# Altium schematic sheet AI_XiaoZhi_4G.SchDoc
size A2; SheetNumber: 1; SheetTotal: 1
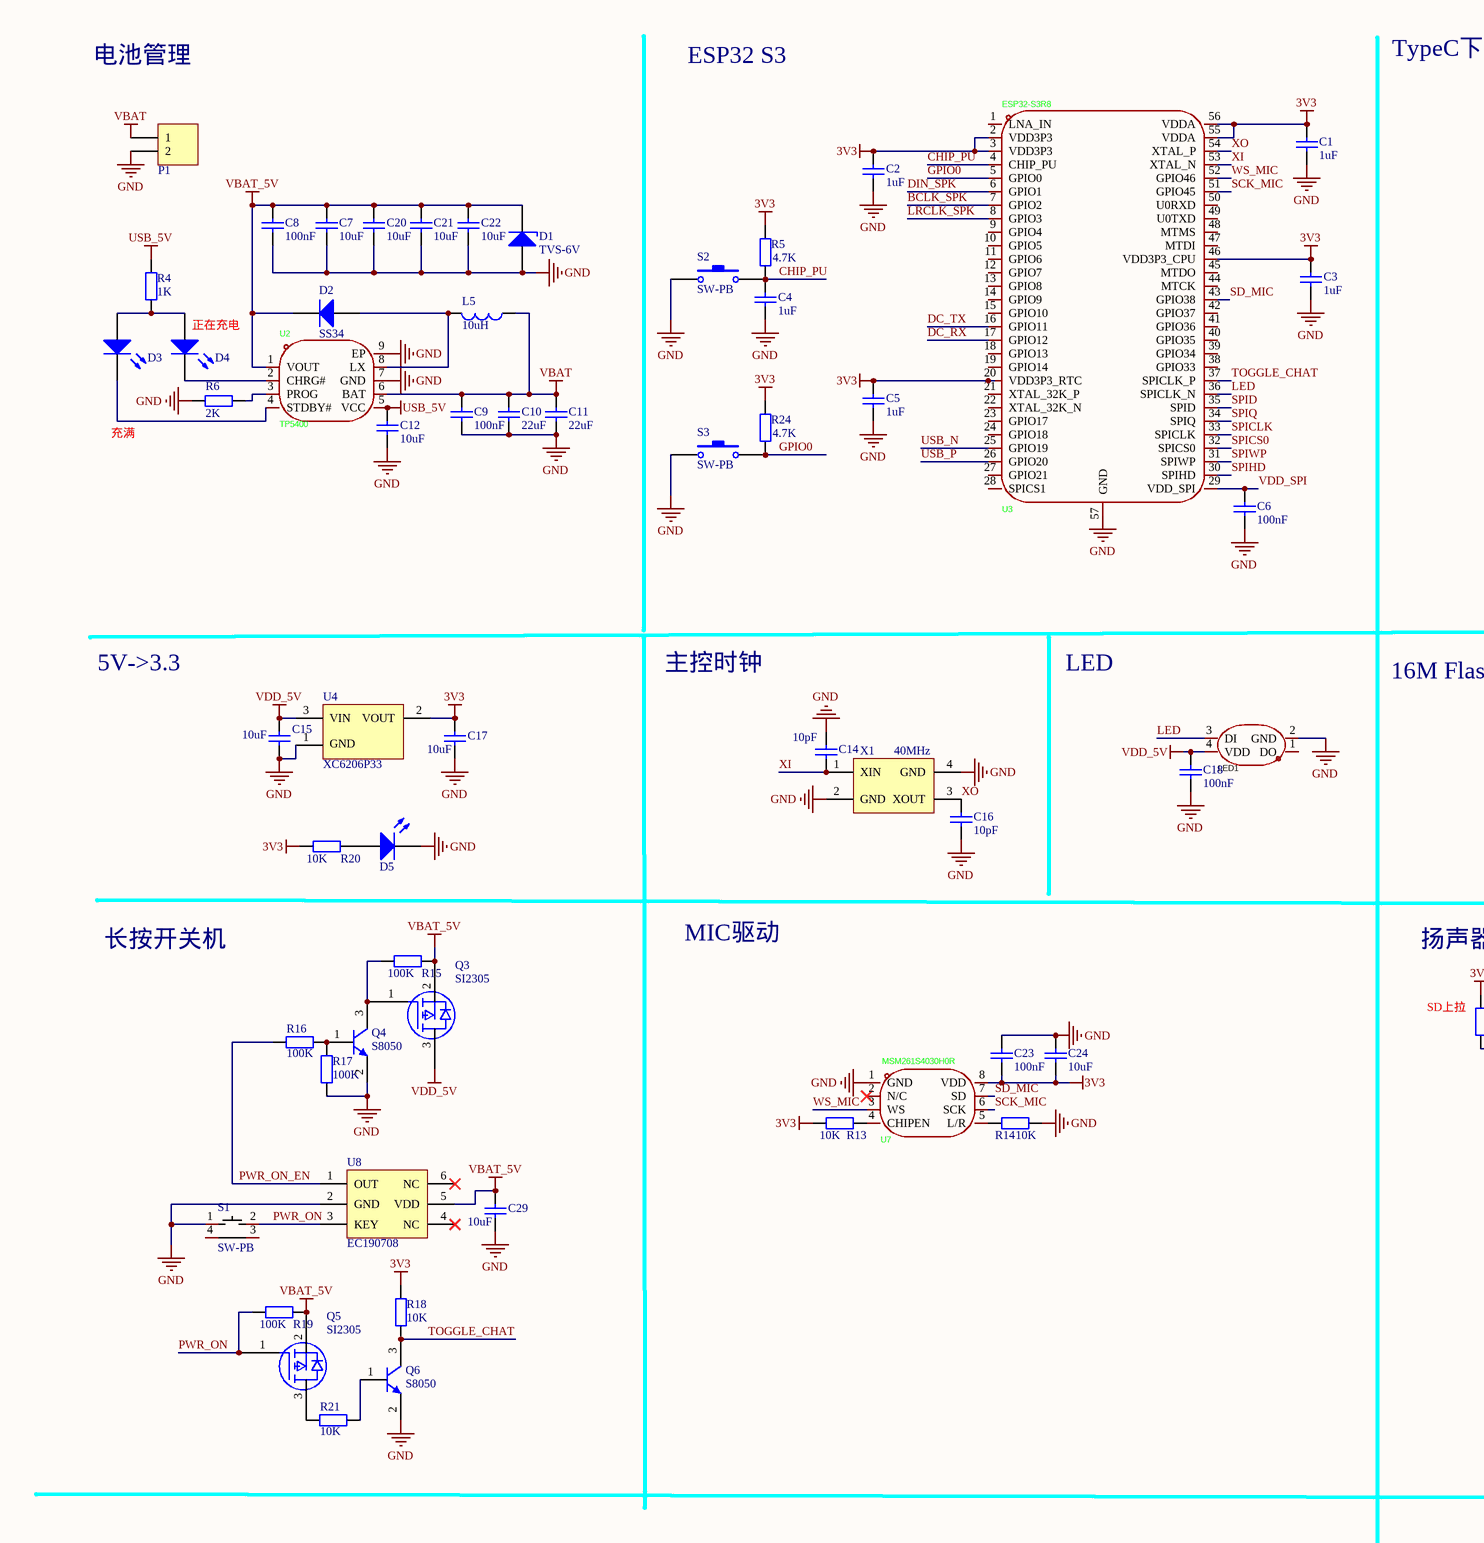
[diagram p0: AI_XiaoZhi_4G.SchDoc, left]
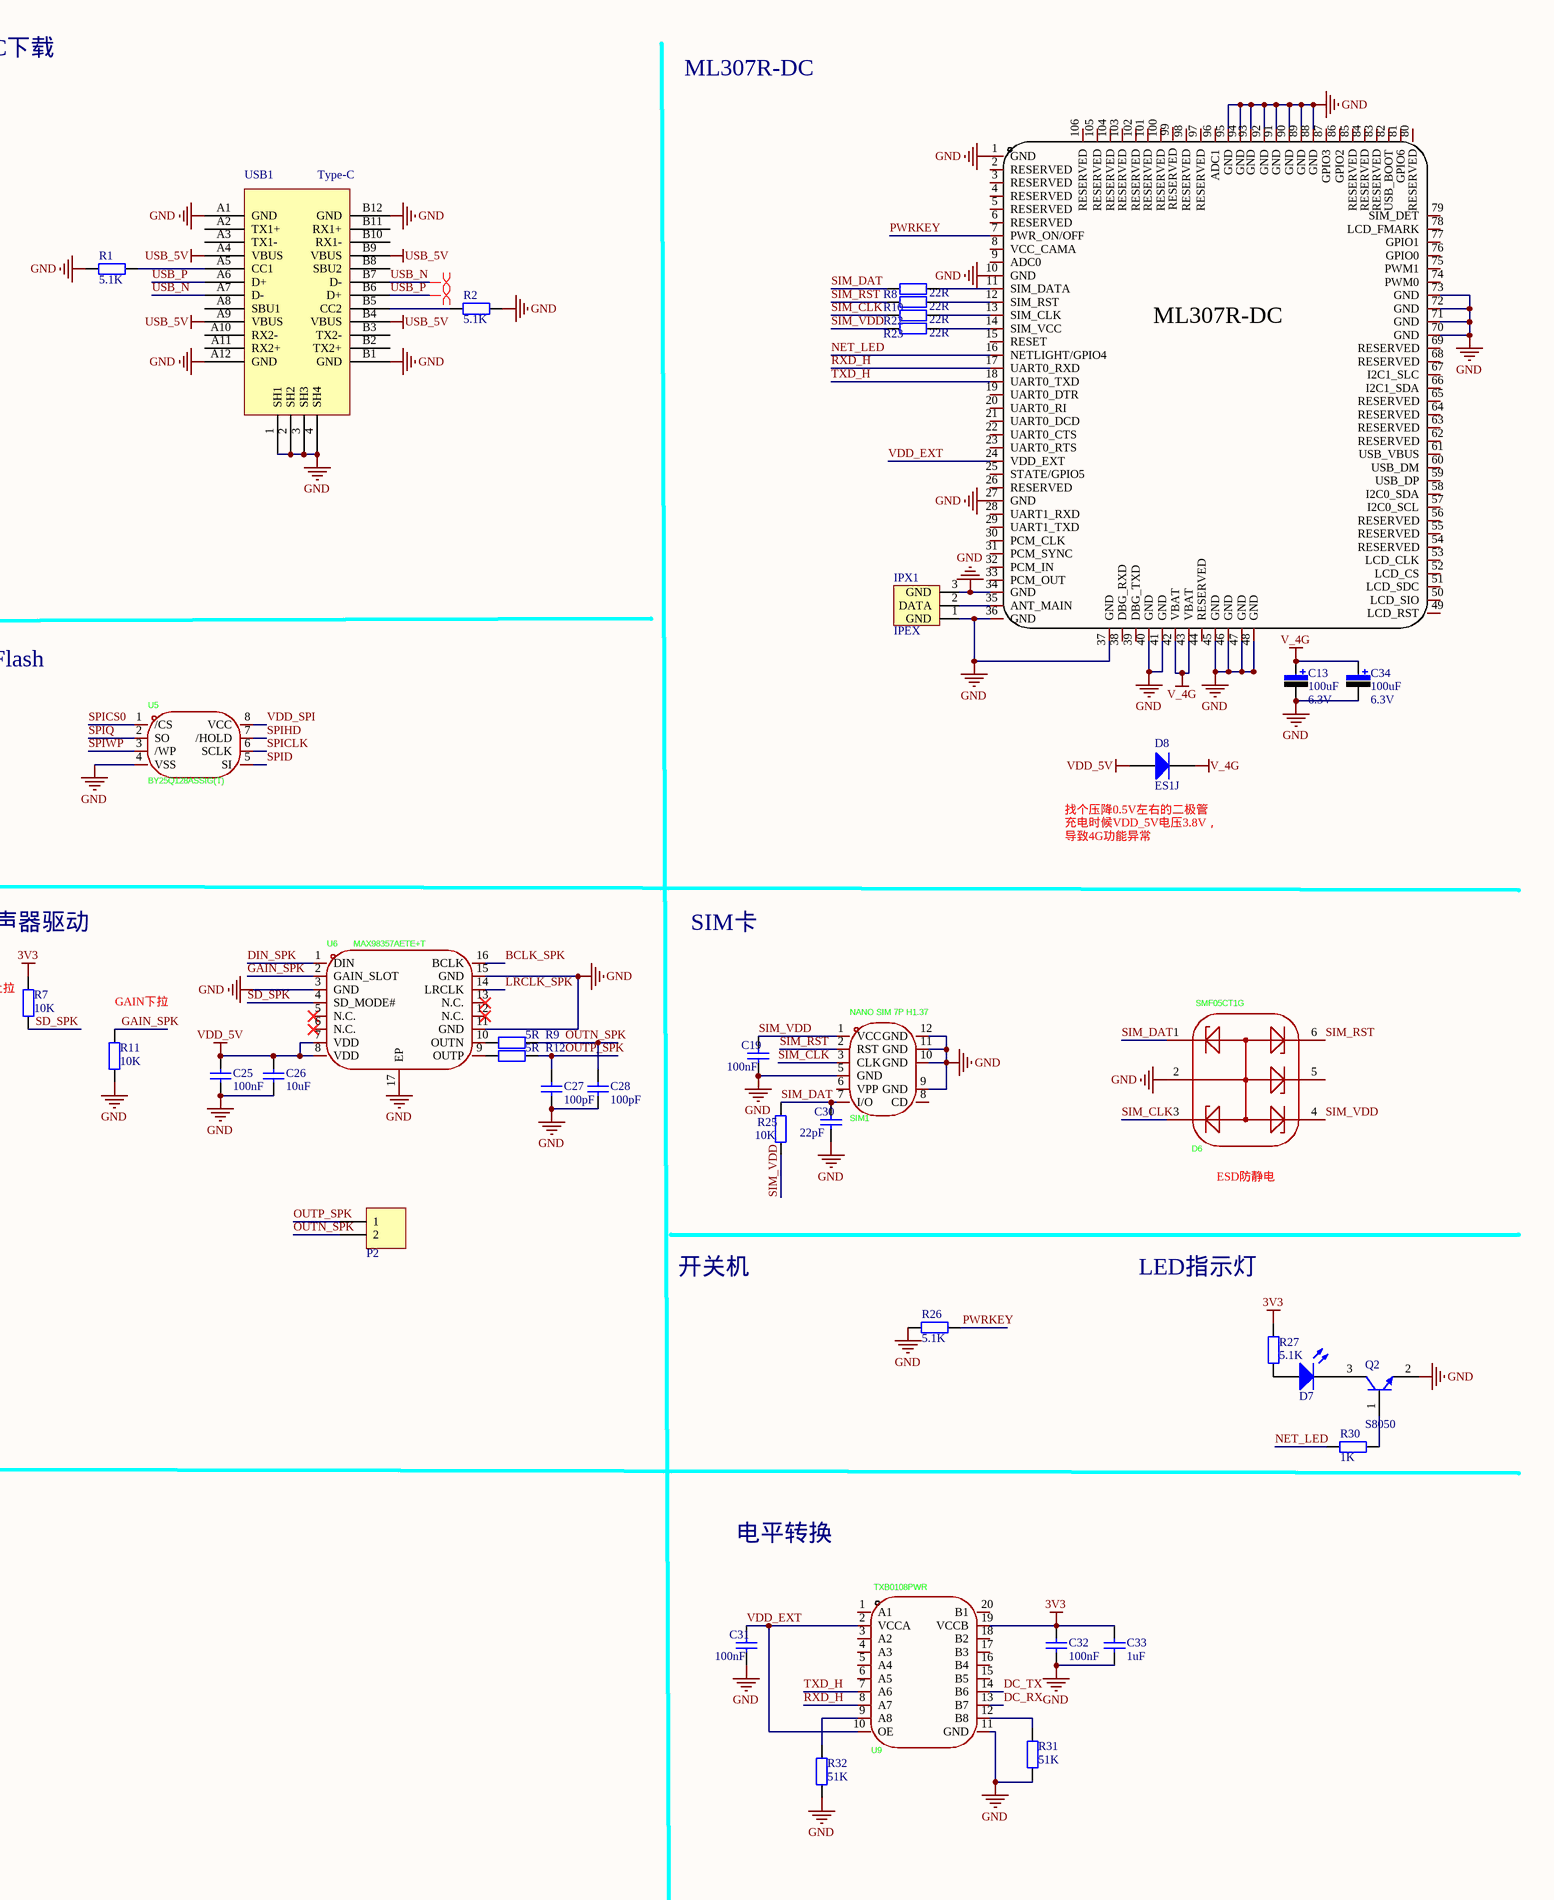
[diagram p1: AI_XiaoZhi_4G.SchDoc, right]

## Parts
C1  value 1uF  [0603-C]  (hidden comment: CAP)
C2  value 1uF  [0603-C]  (hidden comment: CAP)
C3  value 1uF  [0603-C]  (hidden comment: CAP)
C4  value 1uF  [0603-C]  (hidden comment: CAP)
C5  value 1uF  [0603-C]  (hidden comment: CAP)
C6  value 100nF  [0603-C]  (hidden comment: CAP)
C7  value 10uF  [0603-C]  (hidden comment: CAP)
C8  value 100nF  [0603-C]  (hidden comment: CAP)
C9  value 100nF  [0603-C]  (hidden comment: CAP)
C10  value 22uF  [0603-C]  (hidden comment: CAP)
C11  value 22uF  [0603-C]  (hidden comment: CAP)
C12  value 10uF  [0603-C]  (hidden comment: CAP)
C13  value 100uF  Vol: 6.3V  [CASE-A_3216]  (hidden comment: CAP-P)
C14  value 10pF  [0603-C]  (hidden comment: CAP)
C15  value 10uF  [0603-C]  (hidden comment: CAP)
C16  value 10pF  [0603-C]  (hidden comment: CAP)
C17  value 10uF  [0603-C]  (hidden comment: CAP)
C18  value 100nF  [0603-C]  (hidden comment: CAP)
C19  value 100nF  [0603-C]  (hidden comment: CAP)
C20  value 10uF  [0603-C]  (hidden comment: CAP)
C21  value 10uF  [0603-C]  (hidden comment: CAP)
C22  value 10uF  [0603-C]  (hidden comment: CAP)
C23  value 100nF  [0603-C]  (hidden comment: CAP)
C24  value 10uF  [0603-C]  (hidden comment: CAP)
C25  value 100nF  [0603-C]  (hidden comment: CAP)
C26  value 10uF  [0603-C]  (hidden comment: CAP)
C27  value 100pF  [0603-C]  (hidden comment: CAP)
C28  value 100pF  [0603-C]  (hidden comment: CAP)
C29  value 10uF  [0603-C]  (hidden comment: CAP)
C30  value 22pF  [0603-C]  (hidden comment: CAP)
C31  value 100nF  [0603-C]  (hidden comment: CAP)
C32  value 100nF  [0603-C]  (hidden comment: CAP)
C33  value 1uF  [0603-C]  (hidden comment: CAP)
C34  value 100uF  Vol: 6.3V  [CASE-A_3216]  (hidden comment: CAP-P)
D1  value TVS-6V  [DIODE-SMA]  (hidden comment: Diode-Z)
D2  Type: SS34  [DIODE-SMA]  (hidden comment: Diode)
D3  LED  [0603-LED]  (value not drawn)
D4  LED  [0603-LED]  (value not drawn)
D5  LED  [0603-LED]  (value not drawn)
D6  SMF05CT1G  [SOT-363]
D7  LED  [0603-LED]  (value not drawn)
D8  Type: ES1J  [DIODE-SMA]  (hidden comment: Diode)
IPX1  IPEX  [IPEX]
L5  value 10uH  [SMD_L4.4-W4.2]  (hidden comment: Inductor)
LED1  XL-2020RGBC-WS2812B  [LED-SMD_4P-L2.0-W2.0-BR-1]  (value not drawn)
P1  Header 2  [CONN-SMD_2P-P1.25-HC-1.25-2PWT]  (value not drawn)
P2  Header 2  [CONN-SMD_2P-P1.25-HC-1.25-2PWT]  (value not drawn)
Q2  S8050  [SOT-23]
Q3  value SI2305  [SOT-23]  (hidden comment: PMOS)
Q4  S8050  [SOT-23]
Q5  value SI2305  [SOT-23]  (hidden comment: PMOS)
Q6  S8050  [SOT-23]
R1  value 5.1K  [0603-R]  (hidden comment: RES)
R2  value 5.1K  [0603-R]  (hidden comment: RES)
R4  value 1K  [0603-R]  (hidden comment: RES)
R5  value 4.7K  [0603-R]  (hidden comment: RES)
R6  value 2K  [0603-R]  (hidden comment: RES)
R7  value 10K  [0603-R]  (hidden comment: RES)
R8  value 22R  [0603-R]  (hidden comment: RES)
R9  value 5R  [0603-R]  (hidden comment: RES)
R10  value 22R  [0603-R]  (hidden comment: RES)
R11  value 10K  [0603-R]  (hidden comment: RES)
R12  value 5R  [0603-R]  (hidden comment: RES)
R13  value 10K  [0603-R]  (hidden comment: RES)
R14  value 10K  [0603-R]  (hidden comment: RES)
R15  value 100K  [0603-R]  (hidden comment: RES)
R16  value 100K  [0603-R]  (hidden comment: RES)
R17  value 100K  [0603-R]  (hidden comment: RES)
R18  value 10K  [0603-R]  (hidden comment: RES)
R19  value 100K  [0603-R]  (hidden comment: RES)
R20  value 10K  [0603-R]  (hidden comment: RES)
R21  value 10K  [0603-R]  (hidden comment: RES)
R22  value 22R  [0603-R]  (hidden comment: RES)
R23  value 22R  [0603-R]  (hidden comment: RES)
R24  value 4.7K  [0603-R]  (hidden comment: RES)
R25  value 10K  [0603-R]  (hidden comment: RES)
R26  value 5.1K  [0603-R]  (hidden comment: RES)
R27  value 5.1K  [0603-R]  (hidden comment: RES)
R30  value 1K  [0603-R]  (hidden comment: RES)
R31  value 51K  [0603-R]  (hidden comment: RES)
R32  value 51K  [0603-R]  (hidden comment: RES)
S1  SW-PB  [SW_TS]
S2  SW-PB  [SW-SMD_L3.9-W3.0-P4.45]
S3  SW-PB  [SW-SMD_L3.9-W3.0-P4.45]
SIM1  NANO SIM 7P H1.37  [SIM-SMD_NANO-SIM-7P-H1.37]
U1  ML307R-DC  [LGA-109_L17.7-W15.8-AIR780E]  (value not drawn)
U2  TP5400  [ESOP-8]
U3  ESP32-S3R8  [QFN-56_L7.0-W7.0-P0.40-TL-EP4.0]
U4  XC6206P33  [SOT-23]
U5  BY25Q128ASSIG(T)  [SOIC-8]
U6  MAX98357AETE+T  [TQFN-16]
U7  MSM261S4030H0R  [MIC-SMD_8P-L4.0-W3.0-P1.00-BR]
U8  EC190708  [SOT-23-6]
U9  TXB0108PWR  [TSSOP-20_L6.5-W4.4-P0.65-LS6.4-BL]
USB1  Type-C  [Type-C-TOP]
X1  40MHz  [2520-XTAL]

## Nets
3V3: C1.2 C2.1 C3.2 C5.1 C17.2 C23.1 C24.1 C32.2 C33.2 R5.2 R7.2 R13.2 R18.1 R20.2 R24.2 R27.2 U3.2(VDD3P3) U3.3(VDD3P3) U3.20(VDD3P3_RTC) U3.46(VDD3P3_CPU) U3.55(VDDA) U3.56(VDDA) U4.2(VOUT) U7.8(VDD) U9.19(VCCB)
GND: C1.1 C2.2 C3.1 C4.2 C5.2 C6.1 C7.2 C8.2 C9.2 C10.2 C11.2 C12.2 C13.2 C14.2 C15.1 C16.2 C17.1 C18.1 C19.1 C20.2 C21.2 C22.2 C23.2 C24.2 C25.2 C26.2 C27.2 C28.2 C29.1 C30.1 C31.1 C32.1 C33.1 C34.2 D1.1(A) D5.2(K) D6.2 IPX1.1(GND) IPX1.3(GND) LED1.2(GND) P1.2 Q2.2(E) Q4.2(E) Q6.2(E) R1.2 R2.1 R6.2 R11.1 R14.2 R17.2 R26.2 R31.2 R32.2 S1.1 S2.1 S3.1 SIM1.5(GND) SIM1.9(GND) SIM1.10(GND) SIM1.11(GND) SIM1.12(GND) U1.1(GND) U1.10(GND) U1.27(GND) U1.34(GND) U1.36(GND) U1.37(GND) U1.40(GND) U1.41(GND) U1.45(GND) U1.46(GND) U1.47(GND) U1.48(GND) U1.70(GND) U1.71(GND) U1.72(GND) U1.73(GND) U1.88(GND) U1.89(GND) U1.90(GND) U1.91(GND) U1.92(GND) U1.93(GND) U1.94(GND) U1.95(GND) U2.7(GND) U2.9(EP) U3.57(GND) U4.1(GND) U5.4(VSS) U6.3(GND) U6.11(GND) U6.15(GND) U6.17(EP) U7.1(GND) U8.2(GND) U9.11(GND) USB1.1(SH1) USB1.2(SH2) USB1.3(SH3) USB1.4(SH4) USB1.A1(GND) USB1.A12(GND) USB1.B1(GND) USB1.B12(GND) X1.2(GND) X1.4(GND)
USB_5V: C12.1 R4.2 U2.5(VCC) USB1.A4(VBUS) USB1.A9(VBUS) USB1.B4(VBUS) USB1.B9(VBUS)
V_4G: C13.1 C34.1 D8.2(K) U1.42(VBAT) U1.43(VBAT)
VBAT: C9.1 C10.1 C11.1 L5.1 P1.1 U2.6(BAT)
VBAT_5V: C7.1 C8.1 C20.1 C21.1 C22.1 C29.2 D1.2(K) D2.2(K) Q3.2(S) Q5.2(S) R15.1 R19.1 U2.1(VOUT) U8.5(VDD)
VDD_5V: C15.2 C18.2 C25.1 C26.1 D8.1(A) LED1.4(VDD) Q3.3(D) U4.3(VIN) U6.7(VDD) U6.8(VDD)
BCLK_SPK: U3.7(GPIO2) U6.16(BCLK)
CHIP_PU: C4.1 R5.1 S2.2 U3.4(CHIP_PU)
DC_RX: U3.17(GPIO12) U9.13(B7)
DC_TX: U3.16(GPIO11) U9.14(B6)
DIN_SPK: U3.6(GPIO1) U6.1(DIN)
GAIN_SPK: R11.2 U6.2(GAIN_SLOT)
GPIO0: R24.1 S3.2 U3.5(GPIO0)
LED: LED1.3(DI) U3.36(SPICLK_N)
LRCLK_SPK: U3.8(GPIO3) U6.14(LRCLK)
NET_LED: R30.2 U1.16(NETLIGHT/GPIO4)
OUTN_SPK: C28.1 P2.2 R9.2
OUTP_SPK: C27.1 P2.1 R12.2
PWR_ON: Q5.1(G) R19.2 S1.2 U8.3(KEY)
PWR_ON_EN: R16.1 U8.1(OUT)
PWRKEY: R26.1 U1.7(PWR_ON/OFF)
RXD_H: U1.17(UART0_RXD) U9.8(A7)
SCK_MIC: U3.51(GPIO45) U7.6(SCK)
SD_MIC: U3.43(GPIO38) U7.7(SD)
SD_SPK: R7.1 U6.4(SD_MODE#)
SIM_CLK: D6.3 R22.2 SIM1.3(CLK)
SIM_DAT: C30.2 D6.1 R8.2 R25.1 SIM1.7(I/O)
SIM_RST: D6.6 R10.2 SIM1.2(RST)
SIM_VDD: C19.2 D6.4 R23.2 R25.2 SIM1.1(VCC)
SPICLK: U3.33(SPICLK) U5.6(SCLK)
SPICS0: U3.32(SPICS0) U5.1(/CS)
SPID: U3.35(SPID) U5.5(SI)
SPIHD: U3.30(SPIHD) U5.7(/HOLD)
SPIQ: U3.34(SPIQ) U5.2(SO)
SPIWP: U3.31(SPIWP) U5.3(/WP)
TOGGLE_CHAT: Q6.3(C) R18.2 U3.37(SPICLK_P)
TXD_H: U1.18(UART0_TXD) U9.7(A6)
USB_N: U3.25(GPIO19) USB1.A7(D-) USB1.B7(D-)
USB_P: U3.26(GPIO20) USB1.A6(D+) USB1.B6(D+)
VDD_EXT: C31.2 U1.24(VDD_EXT) U9.2(VCCA) U9.10(OE)
VDD_SPI: C6.2 U3.29(VDD_SPI) U5.8(VCC)
WS_MIC: U3.52(GPIO46) U7.3(WS)
XI: C14.1 U3.53(XTAL_N) X1.1(XIN)
XO: C16.1 U3.54(XTAL_P) X1.3(XOUT)
NetD2_1: D2.1(A) L5.2 U2.8(LX)
NetD3_1: D3.1(A) D4.1(A) R4.1
NetD3_2: D3.2(K) U2.4(STDBY#)
NetD4_2: D4.2(K) U2.2(CHRG#)
NetD5_1: D5.1(A) R20.1
NetD7_1: D7.1(A) R27.1
NetD7_2: D7.2(K) Q2.3(C)
NetIPX1_2: IPX1.2(DATA) U1.35(ANT_MAIN)
NetQ2_1: Q2.1(B) R30.1
NetQ3_1: Q3.1(G) Q4.3(C) R15.2
NetQ4_1: Q4.1(B) R16.2 R17.1
NetQ5_3: Q5.3(D) R21.1
NetQ6_1: Q6.1(B) R21.2
NetR1_1: R1.1 USB1.A5(CC1)
NetR2_2: R2.2 USB1.B5(CC2)
NetR6_1: R6.1 U2.3(PROG)
NetR8_1: R8.1 U1.11(SIM_DATA)
NetR9_1: R9.1 U6.10(OUTN)
NetR10_1: R10.1 U1.12(SIM_RST)
NetR12_1: R12.1 U6.9(OUTP)
NetR13_1: R13.1 U7.4(CHIPEN)
NetR14_1: R14.1 U7.5(L/R)
NetR22_1: R22.1 U1.13(SIM_CLK)
NetR23_1: R23.1 U1.14(SIM_VCC)
NetR31_1: R31.1 U9.12(B8)
NetR32_1: R32.1 U9.9(A8)

Not connected (* = marked no-connect by the designer): D6 5; LED1 1(DO); S1 3 4; SIM1 6(VPP) 8(CD); U1 2(RESERVED) 3(RESERVED) 4(RESERVED) 5(RESERVED) 6(RESERVED) 8(VCC_CAMA) 9(ADC0) 15(RESET) 19(UART0_DTR) 20(UART0_RI) 21(UART0_DCD) 22(UART0_CTS) 23(UART0_RTS) 25(STATE/GPIO5) 26(RESERVED) 28(UART1_RXD) 29(UART1_TXD) 30(PCM_CLK) 31(PCM_SYNC) 32(PCM_IN) 33(PCM_OUT) 38(DBG_RXD) 39(DBG_TXD) 44(RESERVED) 49(LCD_RST) 50(LCD_SIO) 51(LCD_SDC) 52(LCD_CS) 53(LCD_CLK) 54(RESERVED) 55(RESERVED) 56(RESERVED) 57(I2C0_SCL) 58(I2C0_SDA) 59(USB_DP) 60(USB_DM) 61(USB_VBUS) 62(RESERVED) 63(RESERVED) 64(RESERVED) 65(RESERVED) 66(I2C1_SDA) 67(I2C1_SLC) 68(RESERVED) 69(RESERVED) 74(PWM0) 75(PWM1) 76(GPIO0) 77(GPIO1) 78(LCD_FMARK) 79(SIM_DET) 80(RESERVED) 81(GPIO6) 82(USB_BOOT) 83(RESERVED) 84(RESERVED) 85(RESERVED) 86(GPIO2) 87(GPIO3) 96(ADC1) 97(RESERVED) 98(RESERVED) 99(RESERVED) 100(RESERVED) 101(RESERVED) 102(RESERVED) 103(RESERVED) 104(RESERVED) 105(RESERVED) 106(RESERVED); U3 1(LNA_IN) 9(GPIO4) 10(GPIO5) 11(GPIO6) 12(GPIO7) 13(GPIO8) 14(GPIO9) 15(GPIO10) 18(GPIO13) 19(GPIO14) 21(XTAL_32K_P) 22(XTAL_32K_N) 23(GPIO17) 24(GPIO18) 27(GPIO21) 28(SPICS1) 38(GPIO33) 39(GPIO34) 40(GPIO35) 41(GPIO36) 42(GPIO37) 44(MTCK) 45(MTDO) 47(MTDI) 48(MTMS) 49(U0TXD) 50(U0RXD); U6 5(N.C.)* 6(N.C.)* 12(N.C.)* 13(N.C.)*; U7 2(N/C)*; U8 4(NC)* 6(NC)*; U9 1(A1) 3(A2) 4(A3) 5(A4) 6(A5) 15(B5) 16(B4) 17(B3) 18(B2) 20(B1); USB1 A2(TX1+) A3(TX1-) A8(SBU1) A10(RX2-) A11(RX2+) B2(TX2+) B3(TX2-) B8(SBU2) B10(RX1-) B11(RX1+)

## Layout directives
differential pair: USB_N, USB_P

## Notes on the sheet
- 电池管理
- ESP32 S3
- TypeC下载
- ML307R-DC
- (near D4) 正在充电
- 充满
- 5V->3.3
- 主控时钟
- LED
- 16M Flash
- (near D8) 找个压降0.5V左右的二极管
  充电时候VDD_5V电压3.8V，
  导致4G功能异常
- 长按开关机
- MIC驱动
- 扬声器驱动
- SIM卡
- (near R7) SD上拉
- (near R11) GAIN下拉
- (near D6) ESD防静电
- 开关机
- LED指示灯
- 电平转换

## Library data of the parts
C1-C12 C14-C33 = CAP: 无极性电容; Published: 8-Jun-2000; LatestRevisionDate: 17-Jul-2002; LatestRevisionNote: Re-released for DXP Platform.; PackageReference: RAD-0.3; Publisher: Altium Limited
C13 C34 = CAP-P: 极性电解电容; Published: 8-Jun-2000; LatestRevisionDate: 17-Jul-2002; LatestRevisionNote: Re-released for DXP Platform.; PackageReference: RB7.6-15; Publisher: Altium Limited
D1 = Diode-Z: 稳压二极管; Published: 8-Jun-2000; LatestRevisionDate: 17-Jul-2002; LatestRevisionNote: Re-released for DXP Platform.; PackageReference: SMB; Publisher: Altium Limited; Code_JEDEC: DO-214-AA
D2 D8 = Diode: 二极管; Published: 8-Jun-2000; LatestRevisionDate: 17-Jul-2002; LatestRevisionNote: Re-released for DXP Platform.; PackageDocument: Sep-1996; PackageReference: SMC; Publisher: Altium Limited; Code_JEDEC: DO-214-AB
D3-D5 D7 = LED: 发光二极管; Published: 8-Jun-2000; LatestRevisionDate: 08-Jul-2005; LatestRevisionNote: Mech Layer 1 removed.; PackageReference: LED-0; Publisher: Altium Limited
D6 = SMF05CT1G: Manufacturer: onsemi(安森美); Add into BOM: yes; Reverse Stand-Off Voltage (Vrwm): 5V; Maximum Clamping Voltage: 12.5V; Peak Pulse Power Dissipation (Ppp)@10/1000us: 100W; Breakdown Voltage: 6.2V; Number of Lines: 五路; Type: ESD; Symbol: SMF05CT1G; Device: SMF05CT1G; LCSC Part Name: SMF05CT1G; Supplier Part: C15879; Manufacturer Part: SMF05CT1G; Supplier Footprint: SOT-363-6; JLCPCB Part Class: Extended Part; Datasheet: https://atta.szlcsc.com/upload/public/pdf/source/20140815/1457707218009.pdf; Supplier: LCSC; Convert to PCB: yes; Operating Temperature: -40℃~+125℃@(Tj)
IPX1 = IPEX-1: IPEX座-1代
L5 = Inductor: 电感; Code_IEC: 1005; Published: 8-Jun-2000; LatestRevisionDate: 17-Jul-2002; LatestRevisionNote: Re-released for DXP Platform.; PackageReference: 0402-A; Publisher: Altium Limited; Code_JEITA: 0402
LED1 = XL-2020RGBC-WS2812B: Manufacturer: XINGLIGHT(成兴光); Add into BOM: yes; Symbol: XL-2020RGBC-WS2812B; Device: XL-2020RGBC-WS2812B; LCSC Part Name: 幻彩透明; Supplier Part: C5349955; Manufacturer Part: XL-2020RGBC-WS2812B; Supplier Footprint: 2020; JLCPCB Part Class: Extended Part; Datasheet: https://atta.szlcsc.com/upload/public/pdf/source/20230111/97A2D5930F183799801175706AF118AF.pdf; Supplier: LCSC; Convert to PCB: yes
P1 P2 = Header 2: 接插件; LatestRevisionDate: 17-Jul-2002; LatestRevisionNote: Re-released for DXP Platform.; Publisher: Altium Limited
Q2 Q4 Q6 = NPN_BJT: NPN三极管; Published: 8-Jun-2000; LatestRevisionDate: 15-Jan-2003; LatestRevisionNote: PCB Footprint 'BCY-W3/D4.7' replaced; DatasheetDocument: 1997; PackageDocument: Sep-1998; PackageReference: TO-92A; Publisher: Altium Limited; Code_JEDEC: TO-92A; ComponentLink1Description: Manufacturer Link; ComponentLink1URL: http://www.fairchildsemi.com/; ComponentLink2Description: Datasheet; ComponentLink2URL: http://www.fairchildsemi.com/ds/2N%2F2N3904.pdf
Q3 Q5 = PMOS: PNP MOS管; PackageDocument: 1995/1996; Published: 8-Jun-2000; LatestRevisionDate: 17-Jul-2002; LatestRevisionNote: Re-released for DXP Platform.; PackageReference: E3; Publisher: Altium Limited
R1 R2 R4-R27 R30-R32 = RES: 贴片电阻; Published: 8-Jun-2000; LatestRevisionDate: 17-Jul-2002; LatestRevisionNote: Re-released for DXP Platform.; PackageReference: AXIAL-0.4; Publisher: Altium Limited
S1 = SW-TS: 微动开关; Published: 24-Mar-1999; LatestRevisionDate: 17-Jul-2002; LatestRevisionNote: Re-released for DXP Platform.; PackageReference: SPST-2; Publisher: Altium Limited
S2 S3 = SW-PB: 微动开关; Published: 24-Mar-1999; LatestRevisionDate: 17-Jul-2002; LatestRevisionNote: Re-released for DXP Platform.; PackageReference: SPST-2; Publisher: Altium Limited
SIM1 = NANO SIM 7P H1.37: Manufacturer: SHOU HAN(首韩); Add into BOM: yes; Card Connection Mode: 自弹式; Card Type: NanoSIM卡; Connector Type: 卡座; Card Detection: 有插卡检测; Body Height (Max): 1.37mm; Symbol: NANO SIM 7P H1.37; Device: NANO SIM 7P H1.37; LCSC Part Name: 自弹式 NanoSIM卡 卡座; Supplier Part: C7529384; Manufacturer Part: NANO SIM 7P H1.37; Supplier Footprint: SMD; JLCPCB Part Class: Extended Part; Datasheet: https://atta.szlcsc.com/upload/public/pdf/source/20230818/0FFC58DEBCCAE2358C5DB79170A6475F.pdf; Supplier: LCSC; Convert to PCB: yes; Supplementary Features: -; Operating Temperature Range: -40℃~+70℃
U1 = ML307R-DC: Name: ML307A-DNLM; Add into BOM: yes; Symbol: ML307R-DC; Device: ML307R-DC; LCSC Part Name: ML307A-DNLM; Supplier Part: C9900016206; Manufacturer Part: ML307A-DNLM; Supplier Footprint: LCC+LGA; JLCPCB Part Class: Extended Part; Datasheet: https://atta.szlcsc.comnull; Supplier: LCSC; Convert to PCB: yes
U2 = TP5400: 单节锂电池充电管理模块; Manufacturer: TOPPOWER(南京拓微); Symbol: TP5400_C2891434; Add into BOM: yes; Device: TP5400; LCSC Part Name: TP5400; Supplier Part: C2891434; Manufacturer Part: TP5400; Supplier Footprint: ESOP-8; JLCPCB Part Class: Extended Part; Datasheet: https://atta.szlcsc.com/upload/public/pdf/source/20210909/352D9D40D77A1DD73F7904E364EF004B.pdf; Supplier: LCSC; Convert to PCB: yes
U3 = ESP32-S3R8: Manufacturer: ESPRESSIF(乐鑫); Symbol: ESP32-S3(R8); Add into BOM: yes; Frequency Range: 2.412GHz~2.484GHz; Interface: I2C,I2S,SPI,UART,USB; Operating Voltage: 3.3V; Output Power: 21dBm; Data Rate: 150Mbps; Sensitivity: -98.4dBm; Device: ESP32-S3R8; LCSC Part Name: ESP32-S3R8; Supplier Part: C2913194; Manufacturer Part: ESP32-S3R8; Supplier Footprint: QFN-56(7x7); JLCPCB Part Class: Extended Part; Datasheet: https://atta.szlcsc.com/upload/public/pdf/source/20231007/CDA236FFCB3F25B7D5220D2CA9867287.pdf; Supplier: LCSC; Convert to PCB: yes; Applications: 蓝牙；WiFi; Operating Temperature: -40℃~+85℃
U4 = XC6206PXXX: LDO稳压芯片
U5 = BY25Q128ASSIG(T): flash; Manufacturer: BOYAMICRO(博雅); Add into BOM: yes; Symbol: BY25Q128ASSIG(T); Device: BY25Q128ASSIG(T); LCSC Part Name: BY25Q128ASSIG(T); Supplier Part: C484307; Manufacturer Part: BY25Q128ASSIG(T); Supplier Footprint: SOP-8-208mil; JLCPCB Part Class: Extended Part; Datasheet: https://atta.szlcsc.com/upload/public/pdf/source/20200115/C484307_596E90FF37B40D62A7480E9A92FA21AA.pdf; Supplier: LCSC; Convert to PCB: yes
U6 = MAX98357AETE+T: 扬声器驱动芯片; Manufacturer: ADI(亚德诺)/MAXIM(美信); Add into BOM: yes; Speaker Channels: 单声道; Output Power: 3.2Wx2@4Ω; Supply Voltage: 2.5V~5.5V; Symbol: MAX98357AETE+T; Device: MAX98357AETE+T; LCSC Part Name: 微型、低成本、PCM 类 D 级放大器具有 AB 级性能; Supplier Part: C910544; Manufacturer Part: MAX98357AETE+T; Supplier Footprint: TQFN-16-EP(3x3); JLCPCB Part Class: Extended Part; Datasheet: https://atta.szlcsc.com/upload/public/pdf/source/20210106/C910544_CB6DE4B2CEE254A72E6BDB40E718D281.pdf; Supplier: LCSC; Convert to PCB: yes; Type of Power Amplifier: -; Operating Temperature: -40℃~+85℃
U7 = MIC: Manufacturer: MEMS(敏芯微); Add into BOM: yes; Symbol: MSM261S4030H0R; Device: MSM261S4030H0R; LCSC Part Name: MSM261S4030H0R; Supplier Part: C2840615; Manufacturer Part: MSM261S4030H0R; Supplier Footprint: -; JLCPCB Part Class: Extended Part; Datasheet: https://atta.szlcsc.com/upload/public/pdf/source/20210707/C2840615_6AE5BCBEE3224C96A8195D5DC270E7C8.pdf; Supplier: LCSC; Convert to PCB: yes
U8 = EC190708: 长按开关机
U9 = TXB0108PWR: Manufacturer: TI(德州仪器); Add into BOM: yes; Channel Type: 双向; Data Rate: 100Mbps; Supply Voltage (VCCA): 1.2V~3.6V; Supply Voltage (VCCB): 1.65V~5.5V; Number of Circuits: 1; Channels per Circuit: 8; Output Type: 三态；非反相; Symbol: TXB0108PWR; Device: TXB0108PWR; LCSC Part Name: 100Mbps 8位双向电平转换器; Supplier Part: C53406; Manufacturer Part: TXB0108PWR; Supplier Footprint: TSSOP-20; JLCPCB Part Class: Extended Part; Datasheet: https://www.ti.com/cn/lit/gpn/txb0108; Supplier: LCSC; Convert to PCB: yes; Input Signal: -; Output Signal: -; Operating Temperature: -40℃~+85℃; Features: 自动方向检测
USB1 = USB-Type-C-TOP: 16Pins TYPEC
X1 = XTAL4G: 无源晶振; MF: ECS International; MP: ECS-3225S30-240-EN-TR; Package: SMD-6 ECS International; Price: 0.75 USD; Availability: Unavailable; Value: *